# Altium schematic sheet [4] Reflective Sensors.SchDoc
size A4; DocumentNumber: 4; SheetNumber: 4; SheetTotal: 5
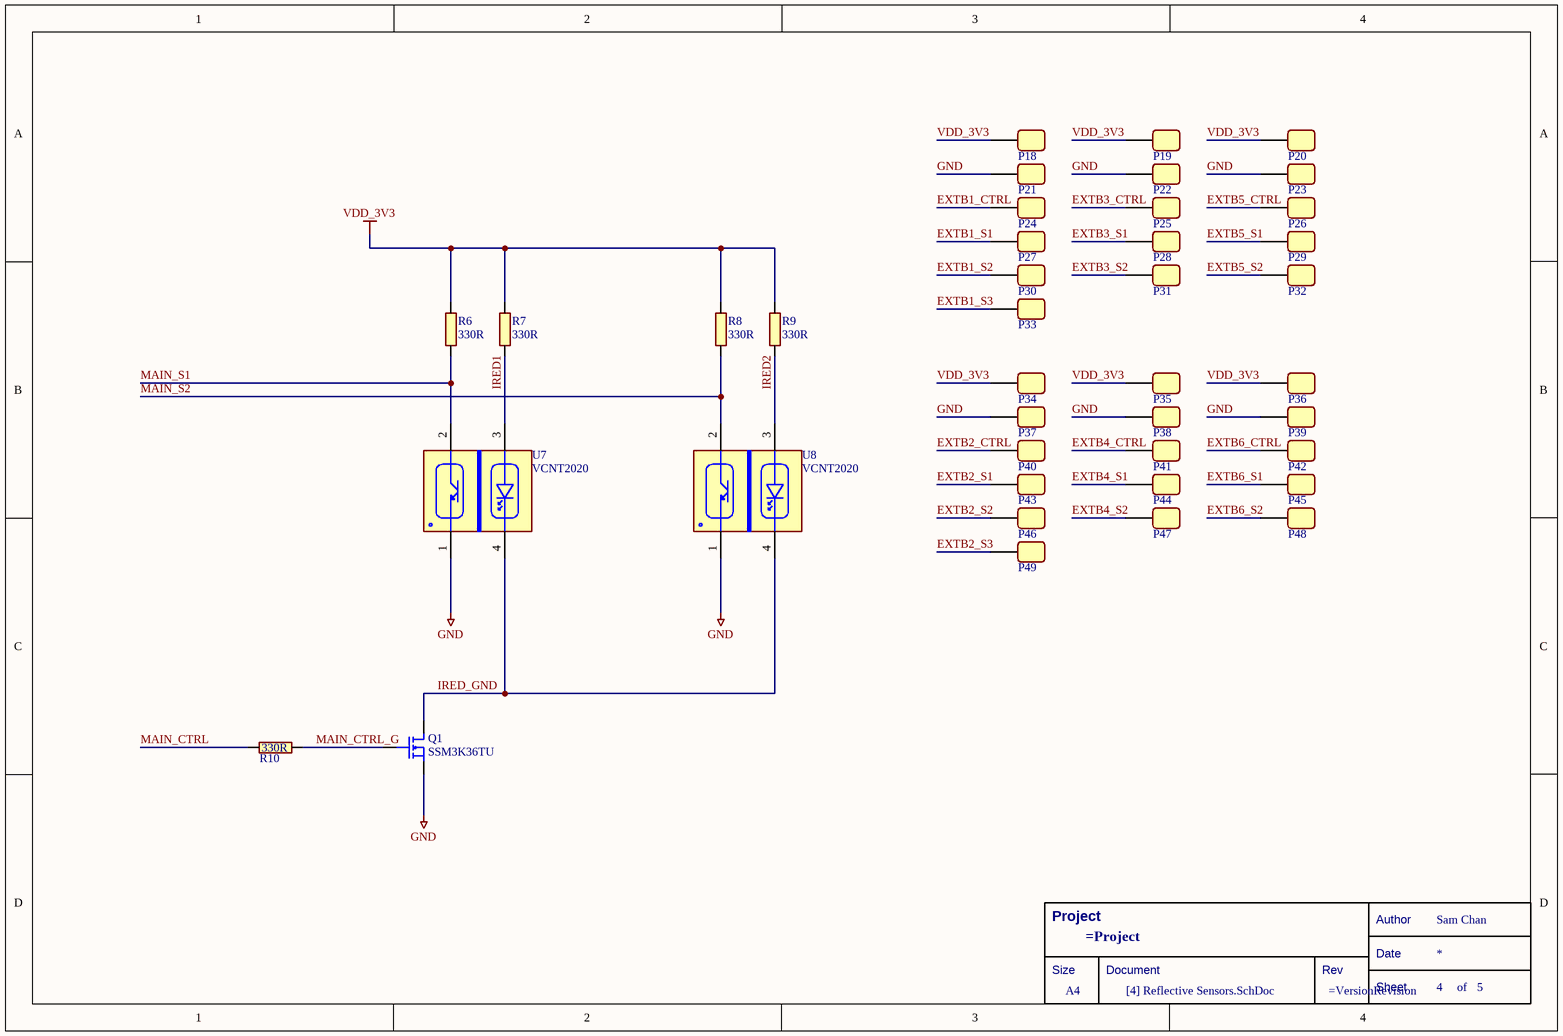
[diagram p0: [4] Reflective Sensors.SchDoc]

## Parts
*  Title Block  (value not drawn)  (graphical)
P18  PAD_4  [PAD_B2B]  (value not drawn)  (no BOM)
P19  PAD_4  [PAD_B2B]  (value not drawn)  (no BOM)
P20  PAD_4  [PAD_B2B]  (value not drawn)  (no BOM)
P21  PAD_4  [PAD_B2B]  (value not drawn)  (no BOM)
P22  PAD_4  [PAD_B2B]  (value not drawn)  (no BOM)
P23  PAD_4  [PAD_B2B]  (value not drawn)  (no BOM)
P24  PAD_4  [PAD_B2B]  (value not drawn)  (no BOM)
P25  PAD_4  [PAD_B2B]  (value not drawn)  (no BOM)
P26  PAD_4  [PAD_B2B]  (value not drawn)  (no BOM)
P27  PAD_4  [PAD_B2B]  (value not drawn)  (no BOM)
P28  PAD_4  [PAD_B2B]  (value not drawn)  (no BOM)
P29  PAD_4  [PAD_B2B]  (value not drawn)  (no BOM)
P30  PAD_4  [PAD_B2B]  (value not drawn)  (no BOM)
P31  PAD_4  [PAD_B2B]  (value not drawn)  (no BOM)
P32  PAD_4  [PAD_B2B]  (value not drawn)  (no BOM)
P33  PAD_4  [PAD_B2B]  (value not drawn)  (no BOM)
P34  PAD_4  [PAD_B2B]  (value not drawn)  (no BOM)
P35  PAD_4  [PAD_B2B]  (value not drawn)  (no BOM)
P36  PAD_4  [PAD_B2B]  (value not drawn)  (no BOM)
P37  PAD_4  [PAD_B2B]  (value not drawn)  (no BOM)
P38  PAD_4  [PAD_B2B]  (value not drawn)  (no BOM)
P39  PAD_4  [PAD_B2B]  (value not drawn)  (no BOM)
P40  PAD_4  [PAD_B2B]  (value not drawn)  (no BOM)
P41  PAD_4  [PAD_B2B]  (value not drawn)  (no BOM)
P42  PAD_4  [PAD_B2B]  (value not drawn)  (no BOM)
P43  PAD_4  [PAD_B2B]  (value not drawn)  (no BOM)
P44  PAD_4  [PAD_B2B]  (value not drawn)  (no BOM)
P45  PAD_4  [PAD_B2B]  (value not drawn)  (no BOM)
P46  PAD_4  [PAD_B2B]  (value not drawn)  (no BOM)
P47  PAD_4  [PAD_B2B]  (value not drawn)  (no BOM)
P48  PAD_4  [PAD_B2B]  (value not drawn)  (no BOM)
P49  PAD_4  [PAD_B2B]  (value not drawn)  (no BOM)
Q1  SSM3K36TU  [SSM3K36TU]
R6  330R  [RESC0402X04N]
R7  330R  [RESC0402X04N]
R8  330R  [RESC0402X04N]
R9  330R  [RESC0402X04N]
R10  330R  [RESC0402X04N]
U7  VCNT2020  [VCNT2020]
U8  VCNT2020  [VCNT2020]

## Nets
GND: P21.1 P22.1 P23.1 P37.1 P38.1 P39.1 Q1.2 U7.1 U8.1
VDD_3V3: P18.1 P19.1 P20.1 P34.1 P35.1 P36.1 R6.2 R7.2 R8.2 R9.2
EXTB1_CTRL: P24.1
EXTB1_S1: P27.1
EXTB1_S2: P30.1
EXTB1_S3: P33.1
EXTB2_CTRL: P40.1
EXTB2_S1: P43.1
EXTB2_S2: P46.1
EXTB2_S3: P49.1
EXTB3_CTRL: P25.1
EXTB3_S1: P28.1
EXTB3_S2: P31.1
EXTB4_CTRL: P41.1
EXTB4_S1: P44.1
EXTB4_S2: P47.1
EXTB5_CTRL: P26.1
EXTB5_S1: P29.1
EXTB5_S2: P32.1
EXTB6_CTRL: P42.1
EXTB6_S1: P45.1
EXTB6_S2: P48.1
IRED1: R7.1 U7.3
IRED2: R9.1 U8.3
IRED_GND: Q1.3 U7.4 U8.4
MAIN_CTRL: R10.2
MAIN_CTRL_G: Q1.1 R10.1
MAIN_S1: R6.1 U7.2
MAIN_S2: R8.1 U8.2

## Notes on the sheet
- (in symbol Title Block) Project; Author; Sam Chan; Date; Size; Document; Rev; A4; Sheet; of

## Library data of the parts
* = Title Block: Standard Title Block
P18-P49 = PAD_4: a Pad for board to board connection
Q1 = SSM3K36TU: N-Channel 20V 500mA (Ta) 800mW (Ta) Surface Mount UFM; Manufacturer: Toshiba Semiconductor and Storage; Categories: Transistors; Case: UFM; Manufacturer Part Number: SSM3K36TU; Supplier 1: SSM3K36TULFCT-ND; Supplier Part Number 1: Digi-Key
R6-R10 = RES 330R: RES SMD 330R OHM 1% 1/16W 0402; Manufacturer: YAGEO; Manufacturer Part Number: RC0402FR-07330RL; Category: Resistors; Package / Case: 0402; Supplier 1: LCSC; Supplier Part Number 1: C105875; Resistance: 330R
U7 U8 = VCNT2020: REFLECTIVE SENSOR WITH PTR OUTPU; Manufacturer: Vishay Semiconductor Opto Division; Category: Optical Sensors; Case: 4-SMD Module; Manufacturer Part Number: VCNT2020; Supplier 1: RS; Supplier Part Number 1: 161-2156